# Altium schematic sheet Digital Port A Button.SchDoc: PORT State Change Buttons
size A4
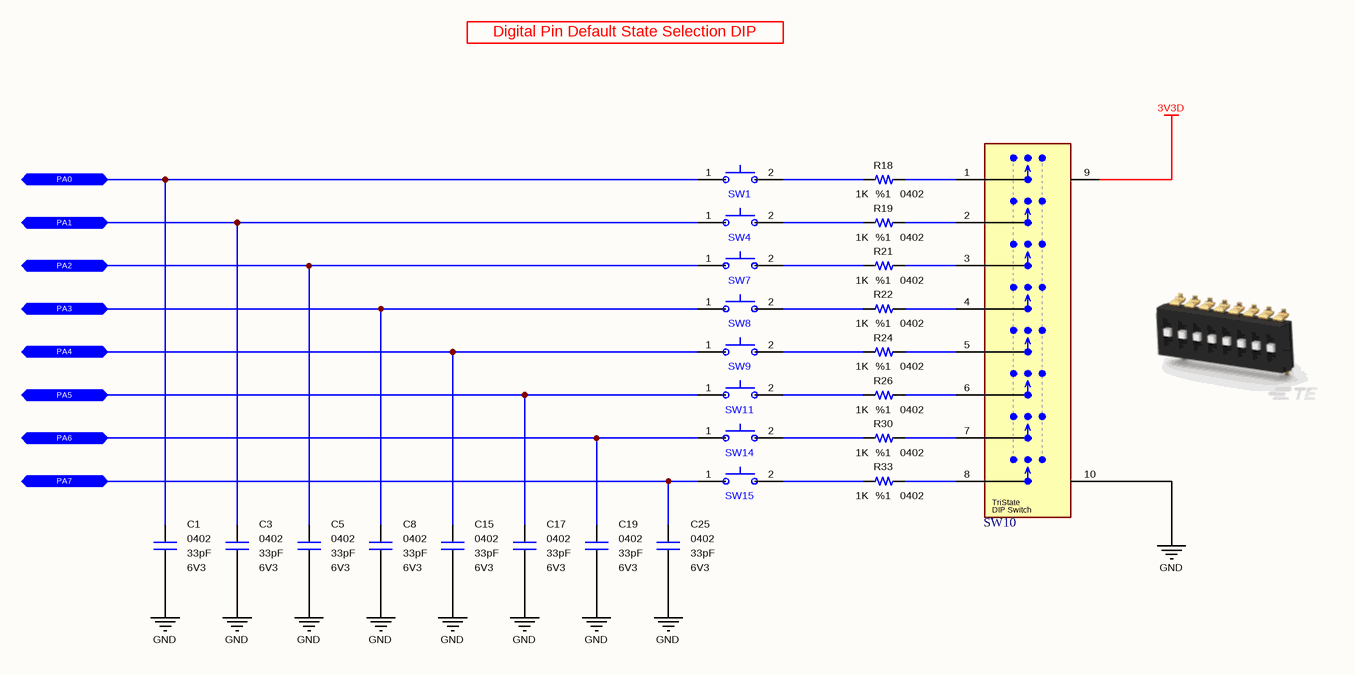
[diagram p0: Digital Port A Button.SchDoc]

## Parts
C1  value 33pF  Case: 0402  Voltage: 6V3  [CAPACITOR_0402]  (hidden comment: Multilayer Ceramic Capacitor)
C3  value 33pF  Case: 0402  Voltage: 6V3  [CAPACITOR_0402]  (hidden comment: Multilayer Ceramic Capacitor)
C5  value 33pF  Case: 0402  Voltage: 6V3  [CAPACITOR_0402]  (hidden comment: Multilayer Ceramic Capacitor)
C8  value 33pF  Case: 0402  Voltage: 6V3  [CAPACITOR_0402]  (hidden comment: Multilayer Ceramic Capacitor)
C15  value 33pF  Case: 0402  Voltage: 6V3  [CAPACITOR_0402]  (hidden comment: Multilayer Ceramic Capacitor)
C17  value 33pF  Case: 0402  Voltage: 6V3  [CAPACITOR_0402]  (hidden comment: Multilayer Ceramic Capacitor)
C19  value 33pF  Case: 0402  Voltage: 6V3  [CAPACITOR_0402]  (hidden comment: Multilayer Ceramic Capacitor)
C25  value 33pF  Case: 0402  Voltage: 6V3  [CAPACITOR_0402]  (hidden comment: Multilayer Ceramic Capacitor)
R18  value 1K  Tolerance: %1  Case: 0402  [RESISTOR_0402]  (hidden comment: Thick Film Resistor)
R19  value 1K  Tolerance: %1  Case: 0402  [RESISTOR_0402]  (hidden comment: Thick Film Resistor)
R21  value 1K  Tolerance: %1  Case: 0402  [RESISTOR_0402]  (hidden comment: Thick Film Resistor)
R22  value 1K  Tolerance: %1  Case: 0402  [RESISTOR_0402]  (hidden comment: Thick Film Resistor)
R24  value 1K  Tolerance: %1  Case: 0402  [RESISTOR_0402]  (hidden comment: Thick Film Resistor)
R26  value 1K  Tolerance: %1  Case: 0402  [RESISTOR_0402]  (hidden comment: Thick Film Resistor)
R30  value 1K  Tolerance: %1  Case: 0402  [RESISTOR_0402]  (hidden comment: Thick Film Resistor)
R33  value 1K  Tolerance: %1  Case: 0402  [RESISTOR_0402]  (hidden comment: Thick Film Resistor)
SW1  Tactile Switches  [PTS526_Switch]  (value not drawn)
SW4  Tactile Switches  [PTS526_Switch]  (value not drawn)
SW7  Tactile Switches  [PTS526_Switch]  (value not drawn)
SW8  Tactile Switches  [PTS526_Switch]  (value not drawn)
SW9  Tactile Switches  [PTS526_Switch]  (value not drawn)
SW10  DIP Switches/SIP Switches  [TDS08SGNNTR04]  (value not drawn)
SW11  Tactile Switches  [PTS526_Switch]  (value not drawn)
SW14  Tactile Switches  [PTS526_Switch]  (value not drawn)
SW15  Tactile Switches  [PTS526_Switch]  (value not drawn)

## Ports
PA0 (bidir), PA1 (bidir), PA2 (bidir), PA3 (bidir), PA4 (bidir), PA5 (bidir), PA6 (bidir), PA7 (bidir)

## Nets
3V3D: SW10.9(VCC)
GND: C1.1 C3.1 C5.1 C8.1 C15.1 C17.1 C19.1 C25.1 SW10.10(GND)
PA0: C1.2 SW1.1(NC) ; port PA0
PA1: C3.2 SW4.1(NC) ; port PA1
PA2: C5.2 SW7.1(NC) ; port PA2
PA3: C8.2 SW8.1(NC) ; port PA3
PA4: C15.2 SW9.1(NC) ; port PA4
PA5: C17.2 SW11.1(NC) ; port PA5
PA6: C19.2 SW14.1(NC) ; port PA6
PA7: C25.2 SW15.1(NC) ; port PA7
NetR18_1: R18.1 SW10.1
NetR18_2: R18.2 SW1.2(COM)
NetR19_1: R19.1 SW10.2
NetR19_2: R19.2 SW4.2(COM)
NetR21_1: R21.1 SW10.3
NetR21_2: R21.2 SW7.2(COM)
NetR22_1: R22.1 SW10.4
NetR22_2: R22.2 SW8.2(COM)
NetR24_1: R24.1 SW10.5
NetR24_2: R24.2 SW9.2(COM)
NetR26_1: R26.1 SW10.6
NetR26_2: R26.2 SW11.2(COM)
NetR30_1: R30.1 SW10.7
NetR30_2: R30.2 SW14.2(COM)
NetR33_1: R33.1 SW10.8
NetR33_2: R33.2 SW15.2(COM)

## Notes on the sheet
- Digital Pin Default State Selection DIP
- Title
- Size:
- Date:
- A4
- Number:
- Time:
- Revision:
- Sheet
- of
- File:
- (in symbol Switch - DIP Switch (8 Pole TriState)) TriState; DIP Switch

## Library data of the parts
C1 C3 C5 C8 C15 C17 C19 C25 = Capacitor - 33pF [0402-6V3]: Capacitor - 33pF [0402] (Ceramic); Manufacturer Name: Kemet; Manufacturer Part Number: C0402C330J9RACAUTO; Dielectric: X7R; Tolerance: 10%; Height: 0.5mm; Mouser Part Number: 80-C0402C330J9RAUTO; Maximum Operating Temperature: +125; Minimum Operating Temperature: -55; ROHS: Yes; ComponentLink1Description: DataSheet; ComponentLink1URL: https://api.kemet.com/component-edge/download/datasheet/C0402C330J9RACAUTO.pdf; ComponentLink2Description: Mouser; ComponentLink2URL: https://www.mouser.com/Search/Refine.aspx?Keyword=80-C0402C330J9RAUTO; Supplier 1: Mouser; Supplier Part Number 1: 80-C0402C330J9RAUTO
R18 R19 R21 R22 R24 R26 R30 R33 = Resistor - 1K: Thick Film Resistors - SMD 1/16 W 1.0 Kohms 1%; Manufacturer Name: Vishay; Manufacturer Part Number: CRCW04021K00FKED; Height: 0.35mm; Mouser Part Number: 71-CRCW0402-1.0K-E3; ComponentLink1Description: DataSheet; ComponentLink1URL: https://www.mouser.com.tr/datasheet/2/427/dcrcwe3-1762152.pdf; ComponentLink2Description: Mouser; ComponentLink2URL: https://www.mouser.com.tr/ProductDetail/Vishay-Dale/CRCW04021K00FKED?qs=sGAEpiMZZMu61qfTUdNhG2DpbjADlD3GFJ4zSbeLqG8%3D; Supplier 1: Mouser; Supplier 2: Digi-Key; Supplier Part Number 1: 71-CRCW0402-1.0K-E3; Supplier Part Number 2: 541-1.00KLCT-ND
SW1 SW4 SW7-SW9 SW11 SW14 SW15 = Switch - Tactile: Tactile Switches 50mA 12VDC, 5.2x5.2mm, 0.8mm H, 260gf, G leads.; Manufacturer Name: C&K Switches; Manufacturer Part Number: PTS526 SK08 SMTR2 LFS; Height: 0.8mm; Mouser Part Number: 611-PTS526SK08SMTR2L; ComponentLink1Description: DataSheet; ComponentLink1URL: https://eu.mouser.com/datasheet/2/60/pts526-1651200.pdf; ComponentLink2Description: Mouser; ComponentLink2URL: https://eu.mouser.com/ProductDetail/CK/PTS526-SK08-SMTR2-LFS?qs=sGAEpiMZZMsgGjVA3toVBL%2FRce%252ByN3s1hQPqiLlQ%252BeM%3D; Supplier 1: Future Electronics; Supplier 2: Mouser; Supplier 3: Arrow; Supplier 4: Digi-Key; Supplier Part Number 1: PTS526SK08SMTR2LFS-REEL; Supplier Part Number 2: 611-PTS526SK08SMTR2L; Supplier Part Number 3: PTS526 SK08 SMTR2 LFS; Supplier Part Number 4: CKN12219-1-ND
SW10 = Switch - DIP Switch (8 Pole TriState): DIP Switches/SIP Switches TRI-STATE DIP 8P G RAISED T&R; Manufacturer Name: TE Connectivity; Manufacturer Part Number: TDS08SGNNTR04; Mouser Part Number: 506-TDS08SGNNTR04; ComponentLink1Description: DataSheet; ComponentLink1URL: https://www.mouser.com.tr/datasheet/2/418/4/NG_DS_1-1773931-8_ALCOSWITCH_DIP_TDS_0917-1221113.pdf; ComponentLink2Description: Mouser; ComponentLink2URL: https://www.mouser.com.tr/ProductDetail/TE-Connectivity-Alcoswitch/TDS08SGNNTR04/?qs=wd5RIQLrsJiLOOX2pWoyQw==